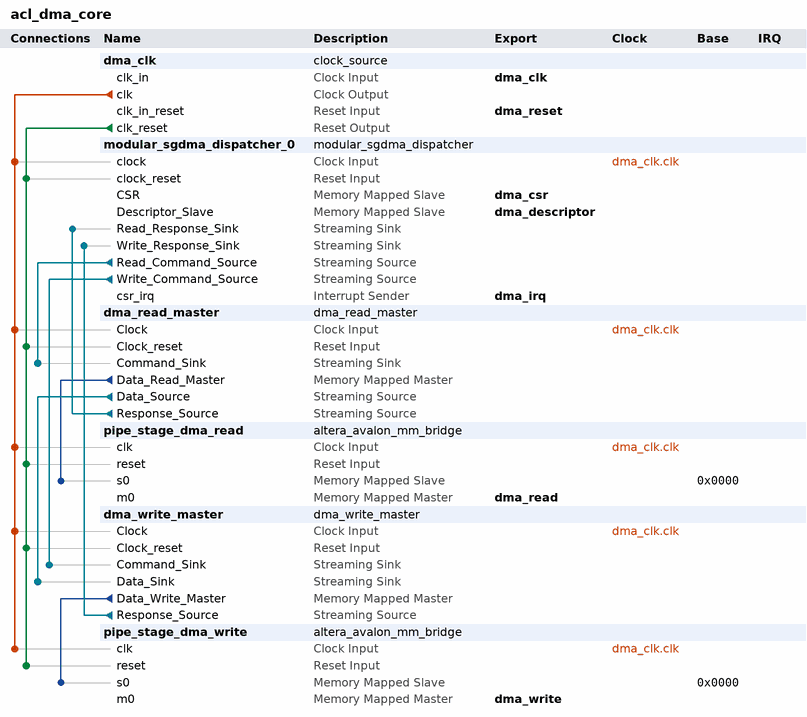
[diagram p0: system contents]
# Platform Designer (Qsys) system acl_dma_core, Arria 10 10AX115N3F40E2SG
# Parameters at their usual value, and those the tool derives, are not listed.
package require -exact qsys 1.0
create_system acl_dma_core
set_project_property DEVICE_FAMILY {Arria 10}
set_project_property DEVICE 10AX115N3F40E2SG

add_component dma_clk ip/acl_dma_core/acl_dma_core_dma_clk.ip clock_source dma_clk 
load_component dma_clk
set_component_parameter_value clockFrequency 50000000
set_component_parameter_value clockFrequencyKnown false
set_component_parameter_value resetSynchronousEdges DEASSERT
save_component

add_component modular_sgdma_dispatcher_0 ip/acl_dma_core/acl_dma_core_modular_sgdma_dispatcher_0.ip modular_sgdma_dispatcher modular_sgdma_dispatcher_0 17.0
load_component modular_sgdma_dispatcher_0
set_component_parameter_value PREFETCHER_USE_CASE 0
set_component_parameter_value MODE 0
set_component_parameter_value GUI_RESPONSE_PORT 2
set_component_parameter_value RESPONSE_PORT 2
set_component_parameter_value DESCRIPTOR_INTERFACE 0
set_component_parameter_value DESCRIPTOR_FIFO_DEPTH 128
set_component_parameter_value ENHANCED_FEATURES 1
set_component_parameter_value DESCRIPTOR_WIDTH 256
set_component_parameter_value DESCRIPTOR_BYTEENABLE_WIDTH 32
set_component_parameter_value CSR_ADDRESS_WIDTH 3
set_component_parameter_value DATA_WIDTH 32
set_component_parameter_value DATA_FIFO_DEPTH 32
set_component_parameter_value MAX_BYTE 1024
set_component_parameter_value TRANSFER_TYPE {Aligned Accesses}
set_component_parameter_value BURST_ENABLE 0
set_component_parameter_value MAX_BURST_COUNT 2
set_component_parameter_value BURST_WRAPPING_SUPPORT 0
set_component_parameter_value STRIDE_ENABLE 0
set_component_parameter_value MAX_STRIDE 1
set_component_parameter_value PROGRAMMABLE_BURST_ENABLE 0
save_component

add_component dma_read_master ip/acl_dma_core/acl_dma_core_dma_read_master.ip dma_read_master dma_read_master 17.0
load_component dma_read_master
set_component_parameter_value DATA_WIDTH 512
set_component_parameter_value LENGTH_WIDTH 20
set_component_parameter_value FIFO_DEPTH 128
set_component_parameter_value USE_FIX_ADDRESS_WIDTH 1
set_component_parameter_value FIX_ADDRESS_WIDTH 49
set_component_parameter_value STRIDE_ENABLE 0
set_component_parameter_value GUI_STRIDE_WIDTH 1
set_component_parameter_value BURST_ENABLE 0
set_component_parameter_value GUI_MAX_BURST_COUNT 16
set_component_parameter_value GUI_PROGRAMMABLE_BURST_ENABLE 0
set_component_parameter_value GUI_BURST_WRAPPING_SUPPORT 1
set_component_parameter_value TRANSFER_TYPE {Full Word Accesses Only}
set_component_parameter_value PACKET_ENABLE 0
set_component_parameter_value ERROR_ENABLE 0
set_component_parameter_value ERROR_WIDTH 8
set_component_parameter_value CHANNEL_ENABLE 0
set_component_parameter_value CHANNEL_WIDTH 8
set_component_parameter_value BYTE_ENABLE_WIDTH 64
set_component_parameter_value BYTE_ENABLE_WIDTH_LOG2 6
set_component_parameter_value ADDRESS_WIDTH 49
set_component_parameter_value FIFO_DEPTH_LOG2 7
set_component_parameter_value SYMBOL_WIDTH 8
set_component_parameter_value NUMBER_OF_SYMBOLS 64
set_component_parameter_value NUMBER_OF_SYMBOLS_LOG2 6
set_component_parameter_value MAX_BURST_COUNT_WIDTH 1
set_component_parameter_value UNALIGNED_ACCESSES_ENABLE 0
set_component_parameter_value ONLY_FULL_ACCESS_ENABLE 1
set_component_parameter_value BURST_WRAPPING_SUPPORT 0
set_component_parameter_value PROGRAMMABLE_BURST_ENABLE 0
set_component_parameter_value MAX_BURST_COUNT 1
set_component_parameter_value FIFO_SPEED_OPTIMIZATION 1
set_component_parameter_value STRIDE_WIDTH 1
save_component

add_component pipe_stage_dma_read ip/acl_dma_core/acl_dma_core_pipe_stage_dma_read.ip altera_avalon_mm_bridge pipe_stage_dma_read 17.0
load_component pipe_stage_dma_read
set_component_parameter_value DATA_WIDTH 512
set_component_parameter_value ADDRESS_WIDTH 49
set_component_parameter_value USE_AUTO_ADDRESS_WIDTH 0
set_component_parameter_value ADDRESS_UNITS SYMBOLS
set_component_parameter_value MAX_PENDING_RESPONSES 64
save_component

add_component dma_write_master ip/acl_dma_core/acl_dma_core_dma_write_master.ip dma_write_master dma_write_master 17.0
load_component dma_write_master
set_component_parameter_value DATA_WIDTH 512
set_component_parameter_value LENGTH_WIDTH 20
set_component_parameter_value FIFO_DEPTH 128
set_component_parameter_value USE_FIX_ADDRESS_WIDTH 1
set_component_parameter_value FIX_ADDRESS_WIDTH 49
set_component_parameter_value STRIDE_ENABLE 0
set_component_parameter_value GUI_STRIDE_WIDTH 1
set_component_parameter_value BURST_ENABLE 0
set_component_parameter_value GUI_MAX_BURST_COUNT 16
set_component_parameter_value GUI_PROGRAMMABLE_BURST_ENABLE 0
set_component_parameter_value GUI_BURST_WRAPPING_SUPPORT 1
set_component_parameter_value TRANSFER_TYPE {Full Word Accesses Only}
set_component_parameter_value PACKET_ENABLE 0
set_component_parameter_value ERROR_ENABLE 0
set_component_parameter_value ERROR_WIDTH 8
set_component_parameter_value BYTE_ENABLE_WIDTH 64
set_component_parameter_value BYTE_ENABLE_WIDTH_LOG2 6
set_component_parameter_value ADDRESS_WIDTH 49
set_component_parameter_value FIFO_DEPTH_LOG2 7
set_component_parameter_value SYMBOL_WIDTH 8
set_component_parameter_value NUMBER_OF_SYMBOLS 64
set_component_parameter_value NUMBER_OF_SYMBOLS_LOG2 6
set_component_parameter_value MAX_BURST_COUNT_WIDTH 1
set_component_parameter_value UNALIGNED_ACCESSES_ENABLE 0
set_component_parameter_value ONLY_FULL_ACCESS_ENABLE 1
set_component_parameter_value BURST_WRAPPING_SUPPORT 0
set_component_parameter_value PROGRAMMABLE_BURST_ENABLE 0
set_component_parameter_value MAX_BURST_COUNT 1
set_component_parameter_value FIFO_SPEED_OPTIMIZATION 1
set_component_parameter_value STRIDE_WIDTH 1
set_component_parameter_value ACTUAL_BYTES_TRANSFERRED_WIDTH 32
save_component

add_component pipe_stage_dma_write ip/acl_dma_core/acl_dma_core_pipe_stage_dma_write.ip altera_avalon_mm_bridge pipe_stage_dma_write 17.0
load_component pipe_stage_dma_write
set_component_parameter_value DATA_WIDTH 512
set_component_parameter_value ADDRESS_WIDTH 49
set_component_parameter_value USE_AUTO_ADDRESS_WIDTH 0
set_component_parameter_value ADDRESS_UNITS SYMBOLS
set_component_parameter_value MAX_PENDING_RESPONSES 64
save_component

# connections
add_connection dma_clk.clk dma_read_master.Clock clock
add_connection dma_clk.clk dma_write_master.Clock clock
add_connection dma_clk.clk modular_sgdma_dispatcher_0.clock clock
add_connection dma_clk.clk pipe_stage_dma_read.clk clock
add_connection dma_clk.clk pipe_stage_dma_write.clk clock
add_connection dma_clk.clk_reset dma_read_master.Clock_reset reset
add_connection dma_clk.clk_reset dma_write_master.Clock_reset reset
add_connection dma_clk.clk_reset modular_sgdma_dispatcher_0.clock_reset reset
add_connection dma_clk.clk_reset pipe_stage_dma_read.reset reset
add_connection dma_clk.clk_reset pipe_stage_dma_write.reset reset
add_connection dma_read_master.Data_Read_Master pipe_stage_dma_read.s0 avalon
set_connection_parameter_value dma_read_master.Data_Read_Master/pipe_stage_dma_read.s0 baseAddress 0x0000
add_connection dma_write_master.Data_Write_Master pipe_stage_dma_write.s0 avalon
set_connection_parameter_value dma_write_master.Data_Write_Master/pipe_stage_dma_write.s0 baseAddress 0x0000
add_connection dma_read_master.Data_Source dma_write_master.Data_Sink avalon_streaming
add_connection dma_read_master.Response_Source modular_sgdma_dispatcher_0.Read_Response_Sink avalon_streaming
add_connection dma_write_master.Response_Source modular_sgdma_dispatcher_0.Write_Response_Sink avalon_streaming
add_connection modular_sgdma_dispatcher_0.Read_Command_Source dma_read_master.Command_Sink avalon_streaming
add_connection modular_sgdma_dispatcher_0.Write_Command_Source dma_write_master.Command_Sink avalon_streaming

# exported interfaces
add_interface dma_clk clock sink
set_interface_property dma_clk EXPORT_OF dma_clk.clk_in
add_interface dma_csr avalon slave
set_interface_property dma_csr EXPORT_OF modular_sgdma_dispatcher_0.CSR
add_interface dma_descriptor avalon slave
set_interface_property dma_descriptor EXPORT_OF modular_sgdma_dispatcher_0.Descriptor_Slave
add_interface dma_irq interrupt sender
set_interface_property dma_irq EXPORT_OF modular_sgdma_dispatcher_0.csr_irq
add_interface dma_read avalon master
set_interface_property dma_read EXPORT_OF pipe_stage_dma_read.m0
add_interface dma_reset reset sink
set_interface_property dma_reset EXPORT_OF dma_clk.clk_in_reset
add_interface dma_write avalon master
set_interface_property dma_write EXPORT_OF pipe_stage_dma_write.m0

set_interconnect_requirement {$system} qsys_mm.clockCrossingAdapter HANDSHAKE
set_interconnect_requirement {$system} qsys_mm.maxAdditionalLatency 2

save_system acl_dma_core.qsys
